# EAGLE design LearningBoardAlternate (EAGLE 7.3.0)
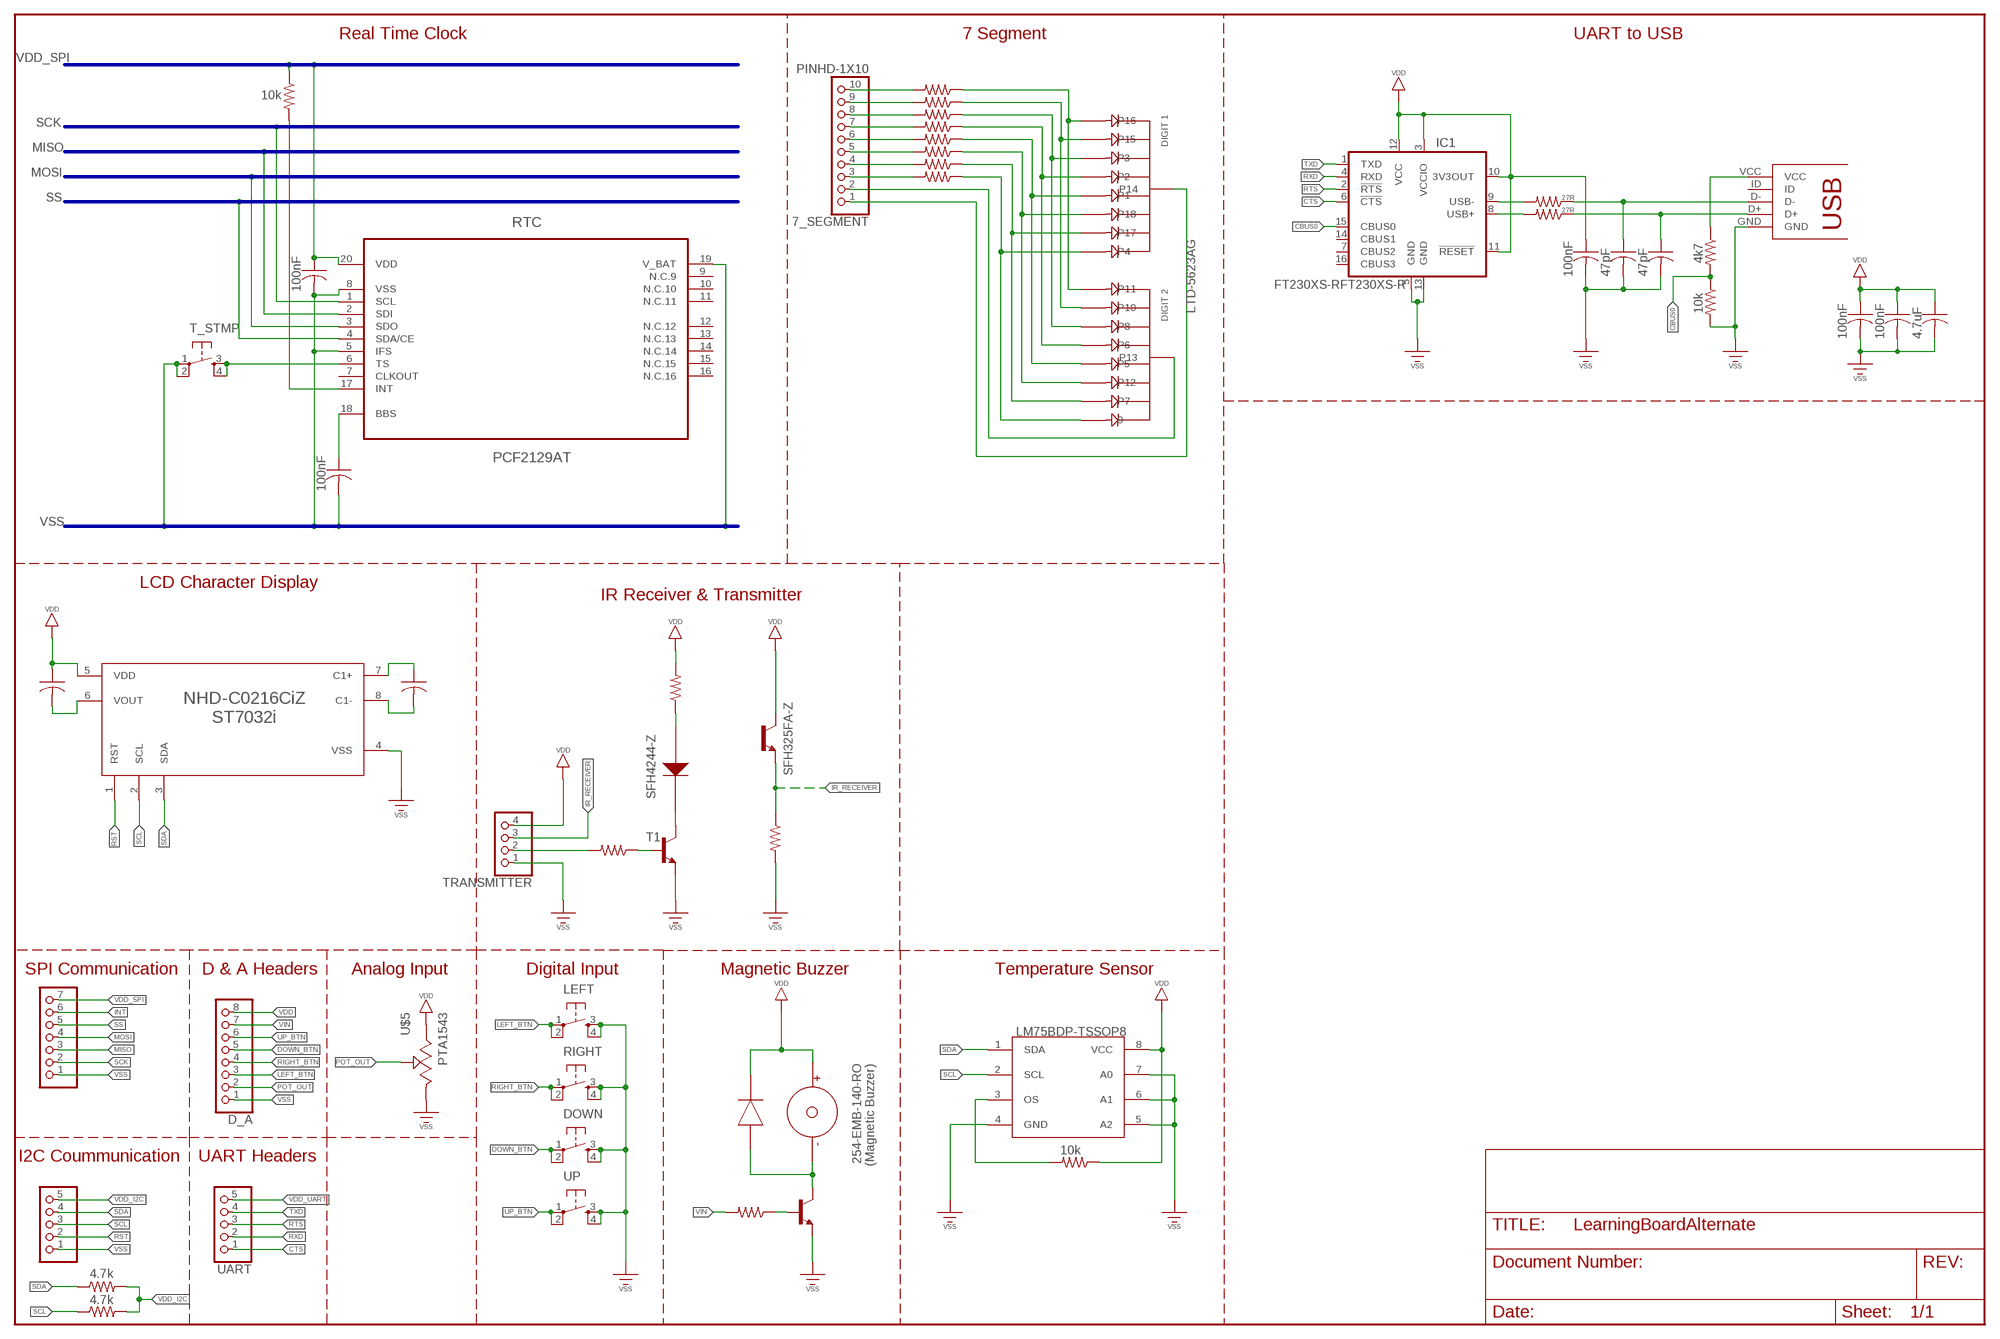
[diagram p0: schematic, sheet 1]

## Parts
7_SEGMENT  PINHD-1X10  [1X10-BIG]
C1  100nF  C-USC0805  [C0805]
C2  100nF  C-USC0805  [C0805]
C3  100nF  C-USC0805  [C0805]
C4  100nF  C-USC0805  [C0805]
C5  100nF  C-USC0805  [C0805]
C6  47pF  C-USC0805  [C0805]
C7  47pF  C-USC0805  [C0805]
C8  4.7uF  C-USC0805  [C0805]
C9  100nF  C-USC0805  [C0805]
C10  100nF  C-USC0805  [C0805]
D_A  PINHD-1X8  [1X08]
DOWN  TAC_SWITCHPTH  [TACTILE-PTH]
I2C  PINHD-1X5  [1X05]
IC1  FT230XS-RFT230XS-R  [FT230XS-R]
LEFT  TAC_SWITCHPTH  [TACTILE-PTH]
RECEIVER_  SFH325FA-Z  [SFH325FA-Z]
RIGHT  TAC_SWITCHPTH  [TACTILE-PTH]
RPU1  4.7k  RESISTOR0805-RES  [0805]
RPU2  4.7k  RESISTOR0805-RES  [0805]
RPU3  4.7k  RESISTOR0805-RES  [0805]
RPU4  10k  RESISTOR0805-RES  [0805]
RPU5  10k  RESISTOR0805-RES  [0805]
RPU6  27R  RESISTOR0805-RES  [0805]
RPU7  4.7k  RESISTOR0805-RES  [0805]
RPU8  4.7k  RESISTOR0805-RES  [0805]
RPU9  4.7k  RESISTOR0805-RES  [0805]
RPU10  4.7k  RESISTOR0805-RES  [0805]
RPU11  4.7k  RESISTOR0805-RES  [0805]
RPU12  10k  RESISTOR0805-RES  [0805]
RPU13  10k  RESISTOR0805-RES  [0805]
RPU14  10k  RESISTOR0805-RES  [0805]
RPU15  10k  RESISTOR0805-RES  [0805]
RPU16  4.7k  RESISTOR0805-RES  [0805]
RPU17  4.7k  RESISTOR0805-RES  [0805]
RPU18  27R  RESISTOR0805-RES  [0805]
RPU19  4k7  RESISTOR0805-RES  [0805]
RPU20  10k  RESISTOR0805-RES  [0805]
SPI  PINHD-1X7  [1X07]
T1  MMBT3904LT1-NPN-SOT23-BEC  [SOT23-BEC]
T2  MMBT3904LT1-NPN-SOT23-BEC  [SOT23-BEC]
T_STMP  TAC_SWITCHPTH  [TACTILE-PTH]
TRANSMITTER  PINHD-1X4  [1X04]
TRANSMITTER_  SFH4244-Z  [SFH4244-Z]
U$1  PCF2129AT  [PCF2129AT]
U$2  NHD-C0216CIZ-FN-FBW-3V  [NHD-C0216CIZ-FN-FBW-3V]
U$3  LTD-5623AG  [LTD-5623AG]
U$5  PTA1543  [PTA1543]
U$8  254-EMB-140-RO  [254-EMB-140-RO]
U$9  1N4148X-TP  [SOD523]
U$10  10118192-0001LF  [10118192-0001LF]
U$11  LM75BDP-TSSOP8  [TSSOP8]
UART  PINHD-1X5  [1X05]
UP  TAC_SWITCHPTH  [TACTILE-PTH]

## Nets
CBUS0: IC1.15(CBUS0) RPU19.2 RPU20.1
CTS: IC1.6(!CTS) UART.1
DIN: RPU13.2 TRANSMITTER.2
DOWN_BTN: D_A.5 DOWN.1 DOWN.2
INT: RPU4.2 SPI.6 U$1.17(INT)
IR_RECEIVER: RECEIVER_.E RPU14.1 TRANSMITTER.3
LEFT_BTN: D_A.3 LEFT.1 LEFT.2
MISO: SPI.3 U$1.2(SDI)
MOSI: SPI.4 U$1.3(SDO)
N$1: C1.2 U$2.6(VOUT)
N$2: C2.1 U$2.7(C1+)
N$3: C2.2 U$2.8(C1-)
N$4: T2.C U$8.NEGATIVE U$9.A
N$5: RPU1.1 U$3.P11 U$3.P16
N$6: RPU2.1 U$3.P10 U$3.P15
N$8: RPU7.1 U$3.P2 U$3.P6
N$9: RPU3.1 U$3.P3 U$3.P8
N$10: RPU8.1 U$3.P1 U$3.P5
N$11: RPU9.1 U$3.P12 U$3.P18
N$12: RPU10.1 U$3.P7 U$3.P17
N$13: RPU11.1 U$3.P4 U$3.P9
N$14: 7_SEGMENT.10 RPU1.2
N$15: 7_SEGMENT.9 RPU2.2
N$16: 7_SEGMENT.8 RPU3.2
N$17: 7_SEGMENT.7 RPU7.2
N$18: 7_SEGMENT.6 RPU8.2
N$19: 7_SEGMENT.5 RPU9.2
N$20: 7_SEGMENT.4 RPU10.2
N$21: 7_SEGMENT.3 RPU11.2
N$22: 7_SEGMENT.2 U$3.P13
N$23: 7_SEGMENT.1 U$3.P14
N$24: T1.C TRANSMITTER_.C
N$25: RPU12.1 TRANSMITTER_.A
N$26: RPU13.1 T1.B
N$27: T_STMP.3 T_STMP.4 U$1.6(TS)
N$29: RPU15.1 T2.B
N$30: C4.1 U$1.18(BBS)
N$31: RPU5.2 U$11.3(OS)
N$33: IC1.9(USB-) RPU6.2
N$34: C7.1 RPU6.1 U$10.D-
N$35: C6.1 RPU18.1 U$10.D+
N$36: IC1.8(USB+) RPU18.2
N$38: RPU19.1 U$10.VCC
POT_OUT: D_A.2 U$5.2
RIGHT_BTN: D_A.4 RIGHT.1 RIGHT.2
RST: I2C.2 U$2.1(RST)
RTS: IC1.2(!RTS) UART.3
RXD: IC1.4(RXD) UART.2
SCK: SPI.2 U$1.1(SCL)
SCL: I2C.3 RPU17.1 U$2.2(SCL) U$11.2(SCL)
SDA: I2C.4 RPU16.1 U$2.3(SDA) U$11.1(SDA)
SS: SPI.5 U$1.4(SDA/CE)
TXD: IC1.1(TXD) UART.4
UP_BTN: D_A.6 UP.1 UP.2
VDD: D_A.8 U$5.3 U$8.POSITIVE U$9.C
VDD_I2C: C1.1 I2C.5 RPU5.1 RPU16.2 RPU17.2 U$2.5(VDD) U$11.8(VCC) ; supply symbol labelled VDD
VDD_IR: RECEIVER_.C RPU12.2 TRANSMITTER.4 ; supply symbol labelled VDD
VDD_SPI: C3.1 RPU4.1 SPI.7 U$1.20(VDD)
VDD_UART: C5.1 C8.1 C9.1 C10.1 IC1.3(VCCIO) IC1.10(3V3OUT) IC1.11(!RESET) IC1.12(VCC) UART.5 ; supply symbol labelled VDD
VIN: D_A.7 RPU15.2
VSS: C3.2 C4.2 C5.2 C6.2 C7.2 C8.2 C9.2 C10.2 D_A.1 DOWN.3 DOWN.4 I2C.1 IC1.5(GND) IC1.13(GND) LEFT.3 LEFT.4 RIGHT.3 RIGHT.4 RPU14.2 RPU20.2 SPI.1 T1.E T2.E T_STMP.1 T_STMP.2 TRANSMITTER.1 U$1.5(IFS) U$1.8(VSS) U$1.19(V_BAT) U$2.4(VSS) U$5.1 U$10.GND U$11.4(GND) U$11.5(A2) U$11.6(A1) U$11.7(A0) UP.3 UP.4
Unconnected: IC1.7(CBUS2) IC1.14(CBUS1) IC1.16(CBUS3) U$1.7(CLKOUT) U$1.9(N.C.9) U$1.10(N.C.10) U$1.11(N.C.11) U$1.12(N.C.12) U$1.13(N.C.13) U$1.14(N.C.14) U$1.15(N.C.15) U$1.16(N.C.16) U$10.ID

## Buses
VDD_SPI
SCK
MISO
MOSI
SS
VSS

## Notes on the sheet
- Real Time Clock | 7 Segment | UART to USB
- LCD Character Display
- IR Receiver & Transmitter
- SPI Communication | D & A Headers | Analog Input | Digital Input | Magnetic Buzzer | Temperature Sensor
- I2C Coummunication | UART Headers

## Library data of the parts
7_SEGMENT = adafruit:PINHD-1X10: Pin header 1x10 0.1" spacing With round pins
C1-C10 = resistor:C-US: CAPACITOR, American symbol
D_A = pinhead:PINHD-1X8: PIN HEADER
DOWN LEFT RIGHT T_STMP UP = SparkFun-Electromechanical:TAC_SWITCH: Momentary Switch Button commonly used for reset or general input. Spark Fun Electronics SKU : COM-00097 SMT- SWCH-08247
I2C UART = pinhead:PINHD-1X5: PIN HEADER
IC1 = AllAboutEE:FT230XS-R: BASIC USB to UART IC
RECEIVER_ = AllAboutEE:SFH325FA-Z: PHOTOTRANSISTOR; IC_ON_MAX: 15mA; MF: Osram Opto Semiconductor; MPN: SFH 325 FA-Z; VCE_SAT: 150mV; WAVELENGTH: 980nm
RPU1-RPU20 = SparkFun-Passives:RESISTOR: Resistor Basic schematic elements and footprints for 0603, 1206, and PTH resistors.
SPI = pinhead:PINHD-1X7: PIN HEADER
T1 T2 = transistor:*-NPN-: NPN Transistror BF959 corrected 2008.03.06
TRANSMITTER = pinhead:PINHD-1X4: PIN HEADER
TRANSMITTER_ = AllAboutEE:SFH4244-Z: Infrared Emitters - High Power HIGH PWR 940nm HALF ANGLE +/-60DEG
U$1 = AllAboutEE:PCF2129AT
U$2 = AllAboutEE:NHD-C0216CIZ-FN-FBW-3V: LCD Character Display Modules & Accessories; CONTROLLER: ST7032i-oD; COUNT_LINE: 16x2; DISPLAY_MODE: Transflective; INTERFACE: I2C; MANUFACTURER: Newhaven Display; VSUPPLY: 3v; VSUPPLY_MAX: 3.3v
U$3 = AllAboutEE:LTD-5623AG
U$5 = AllAboutEE:PTA1543: Slide Potentiometers 10MM SHAFT NO DET 15MM STRK SNG LIN 10 kOhms 50 mW 20 %; POWER_RATING: 50mW; RESISTANCE: 10kOhms; TOLERANCE: 20%
U$8 = AllAboutEE:254-EMB-140-RO: Magnetic Buzzer. Audio Indicators & Alerts 12 x 8.5mm 2048Hz; CURRENT_RATING: 35mA; FREQUENCY: 2048Hz
U$9 = AllAboutEE:1N4148X-TP
U$10 = AllAboutEE:10118192-0001LF: USB Connectors 5P MICRO USB TYPE B RECEPTACLE.; COLOR: Black; GENDER: Female
U$11 = AllAboutEE:LM75BDP-TSSOP8; INTERFACE: I2C, 2-Wire, SMBus; MAX_OPERATING_TEMPERATURE: +125C; MINIMUM_OPERATING_TEMPERATURE: -55C; RESOLUTION: 11 bit; VSUPPLY_MAX: 5.5v; VSUPPLY_MIN: 2.8v

## Board
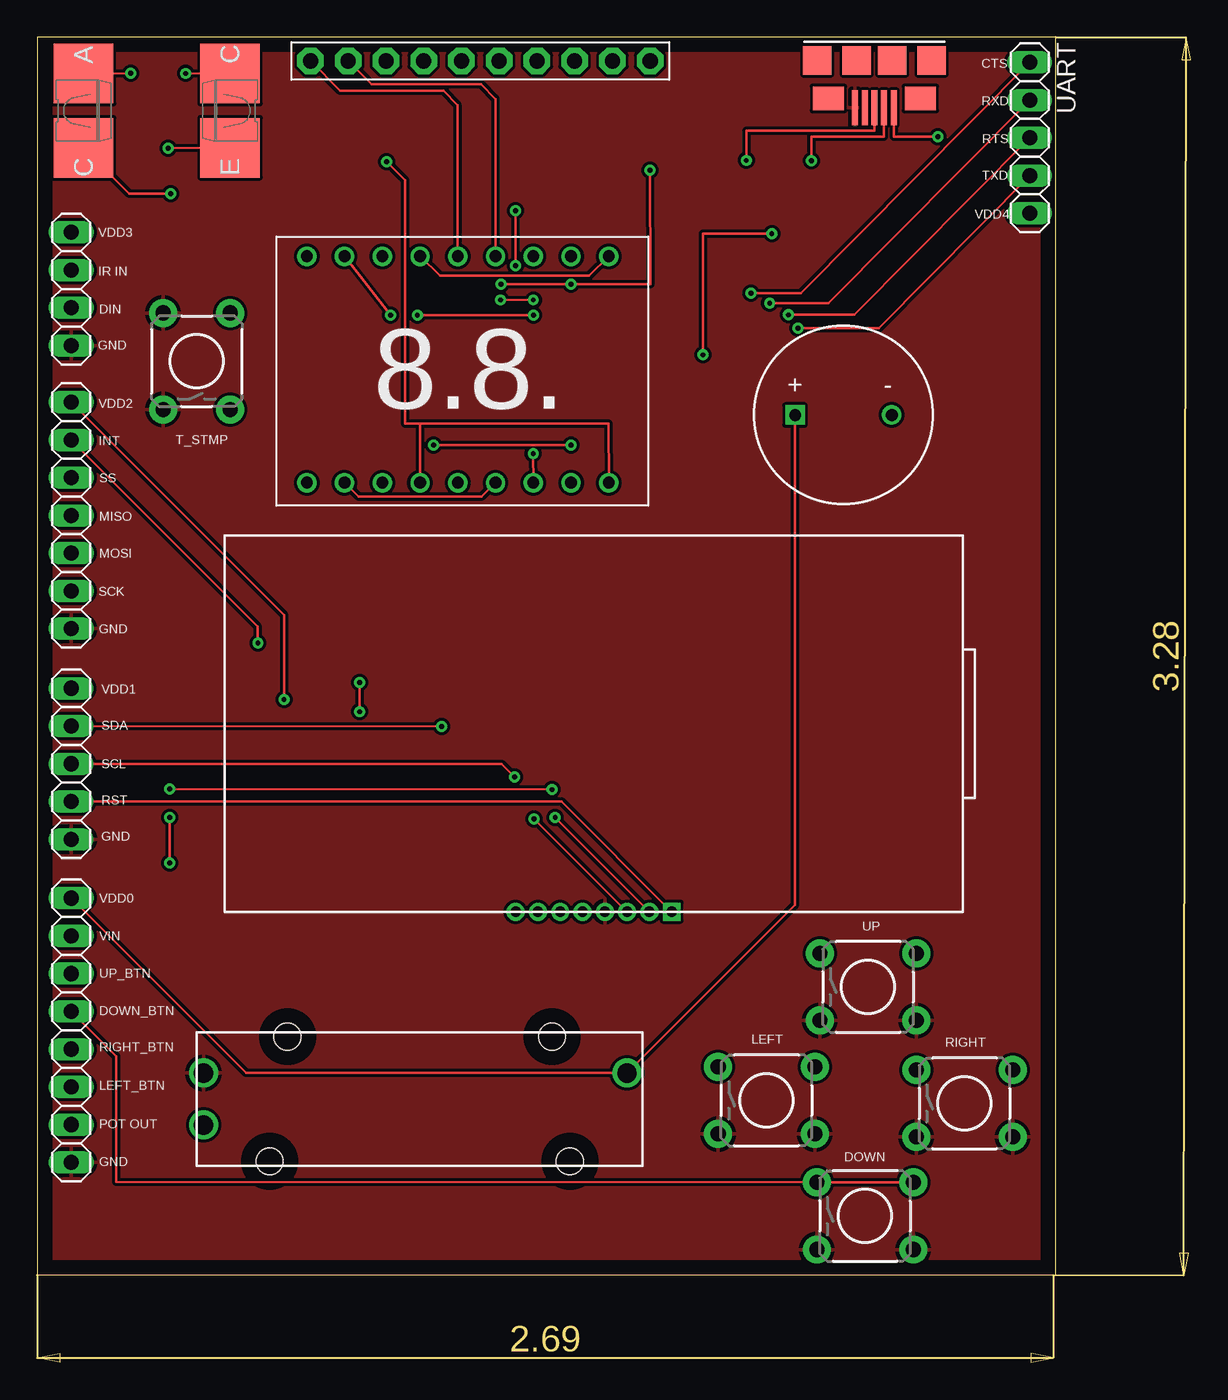
[diagram p1: board, top side]
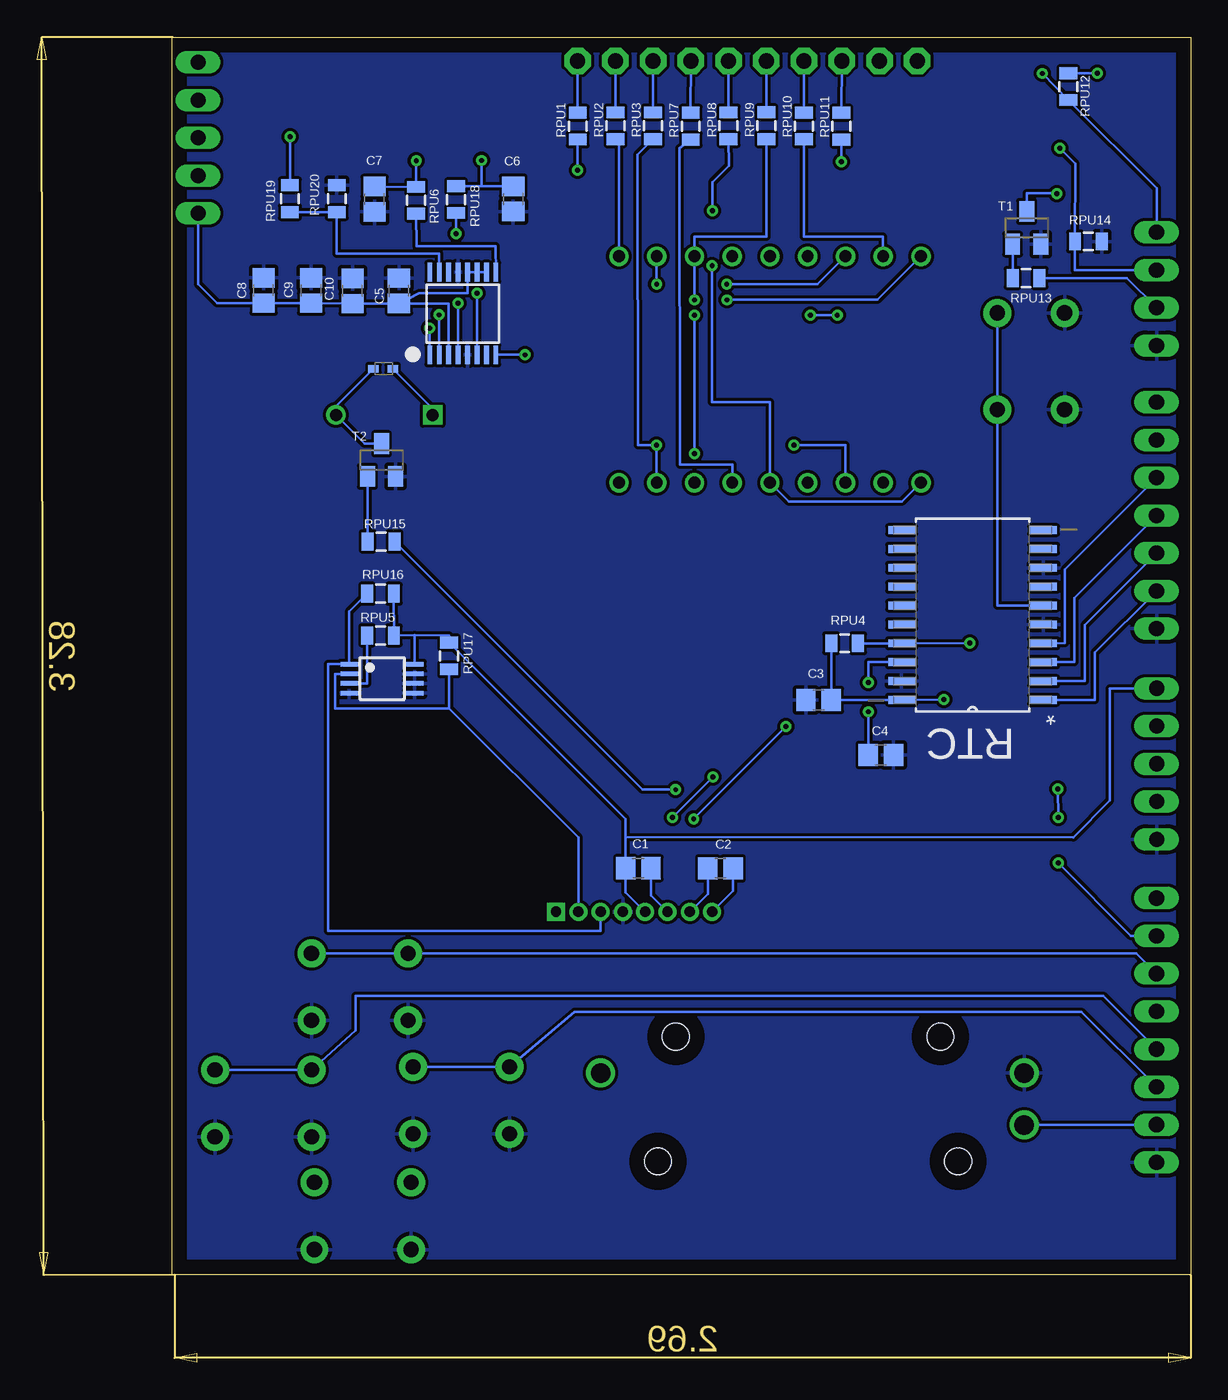
[diagram p2: board, bottom side, seen from below]

Size 68.53 x 83.29 mm. Coordinates in mm from the lower left corner, seen from the top.
Outline: 0,0 68.53,0 68.53,83.29 0,83.29 0,0
Copper layers (1*16): Top 0.035mm / dielectric 1.5mm / Bottom 0.035mm
Design rules "default": minimum track width 10mil, minimum drill 24mil, track to track 8mil, track to pad 8mil, pad to pad 8mil, via to via 8mil, smd to smd 8mil, copper to edge 40mil, drill to drill 8mil, minimum pad ring 10mil, minimum via ring 8mil, stop-mask expansion 4mil, vias tented up to drill 0mil, thermal gap 10mil

### Footprints (pad centres in the part's own frame; a part is rotated, then mirrored left to right if it is on the bottom)
1X10-BIG = drill 1.016 pad 1.778 octagon: 1 -11.43,0; 2 -8.89,0; 3 -6.35,0; 4 -3.81,0; 5 -1.27,0; 6 1.27,0; 7 3.81,0; 8 6.35,0; 9 8.89,0; 10 11.43,0
C0805 = smd 1.3 x 1.5: 1 -0.85,0; 2 0.85,0
1X08 = drill 1.016 long: 1 -8.89,0; 2 -6.35,0; 3 -3.81,0; 4 -1.27,0; 5 1.27,0; 6 3.81,0; 7 6.35,0; 8 8.89,0
TACTILE-PTH = drill 1.016 pad 1.88: 1 -3.251,2.261; 2 3.251,2.261; 3 -3.251,-2.261; 4 3.251,-2.261
1X05 = drill 1.016 long: 1 -5.08,0; 2 -2.54,0; 3 0,0; 4 2.54,0; 5 5.08,0
FT230XS-R = smd 0.32 x 1.26: 1 -2.223,-2.779; 2 -1.588,-2.779; 3 -0.953,-2.779; 4 -0.318,-2.779; 5 0.317,-2.779; 6 0.952,-2.779; 7 1.587,-2.779; 8 2.222,-2.779; 9 2.222,2.779; 10 1.587,2.779; 11 0.952,2.779; 12 0.317,2.779; 13 -0.318,2.779; 14 -0.953,2.779; 15 -1.588,2.779; 16 -2.223,2.779
SFH325FA-Z = smd 4 x 4: C 0,-2.5; E 0,2.5
0805 = smd 0.8 x 1.2: 1 -0.9,0; 2 0.9,0
1X07 = drill 1.016 long: 1 -7.62,0; 2 -5.08,0; 3 -2.54,0; 4 0,0; 5 2.54,0; 6 5.08,0; 7 7.62,0
SOT23-BEC = smd 1 x 1.4: B -0.95,-1.1; C 0,1.1; E 0.95,-1.1
1X04 = drill 1.016 long: 1 -3.81,0; 2 -1.27,0; 3 1.27,0; 4 3.81,0
SFH4244-Z = smd 4 x 4: A 0,2.5; C 0,-2.5
PCF2129AT = smd 1.803 x 0.533: 1 -4.775,5.715; 2 -4.775,4.445; 3 -4.775,3.175; 4 -4.775,1.905; 5 -4.775,0.635; 6 -4.775,-0.635; 7 -4.775,-1.905; 8 -4.775,-3.175; 9 -4.775,-4.445; 10 -4.775,-5.715; 11 4.775,-5.715; 12 4.775,-4.445; 13 4.775,-3.175; 14 4.775,-1.905; 15 4.775,-0.635; 16 4.775,0.635; 17 4.775,1.905; 18 4.775,3.175; 19 4.775,4.445; 20 4.775,5.715
NHD-C0216CIZ-FN-FBW-3V = drill 0.7 square: 1 30.1,-25.3 | drill 0.7: 2 28.6,-25.3; 3 27.1,-25.3; 4 25.6,-25.3; 5 24.1,-25.3; 6 22.6,-25.3; 7 21.1,-25.3; 8 19.6,-25.3
LTD-5623AG = drill 0.8: P1 2.04,1.54; P2 4.58,1.54; P3 7.12,1.54; P4 9.66,1.54; P5 12.2,1.54; P6 14.74,1.54; P7 17.28,1.54; P8 19.82,1.54; P9 22.36,1.54; P10 22.36,16.78; P11 19.82,16.78; P12 17.28,16.78; P13 14.74,16.78; P14 12.2,16.78; P15 9.66,16.78; P16 7.12,16.78; P17 4.58,16.78; P18 2.04,16.78
PTA1543 = drill 1.3: 1 0.45,6.25; 2 0.45,2.75; 3 28.95,6.25 | hole 1.8: 4.9,0.3; 6.1,8.7; 23.9,8.7; 25.1,0.3
254-EMB-140-RO = drill 0.8: NEGATIVE 3.25,0 | drill 0.8 square: POSITIVE -3.25,0
SOD523 = smd 0.7 x 0.5: A 0.7,0; C -0.6,0
10118192-0001LF = smd 0.4 x 2.35: D+ -0.05,1.725; D- -0.7,1.725; GND 1.25,1.725; ID 0.6,1.725; VCC -1.35,1.725 | smd 2.1 x 1.6: P$1 -3.15,1.1; P$2 3.05,1.1 | smd 1.9 x 1.9: P$3 -3.9,-1.45; P$4 -1.25,-1.45; P$5 1.15,-1.45; P$6 3.8,-1.45
TSSOP8 = smd 1.2 x 0.305: 1 -2.2,0.975; 2 -2.2,0.325; 3 -2.2,-0.325; 4 -2.2,-0.975; 5 2.2,-0.975; 6 2.2,-0.325; 7 2.2,0.325; 8 2.2,0.975

### Placement (x,y rotation side)
7_SEGMENT  29.82,81.69 0 top
C1  37.16,27.36 0 bottom
C2  31.64,27.35 0 bottom
C3  25.03,38.68 180 bottom
C4  20.84,34.98 0 bottom
C5  53.27,66.22 90 bottom
C6  45.58,72.4 270 bottom
C7  54.91,72.38 270 bottom
C8  62.38,66.24 90 bottom
C9  59.18,66.24 90 bottom
C10  56.4,66.21 90 bottom
D_A  2.29,16.46 90 top
DOWN  55.71,3.96 0 top
I2C  2.28,34.39 90 top
IC1  48.97,64.69 0 bottom
LEFT  49.08,11.74 0 top
RECEIVER_  12.98,78.33 180 top
RIGHT  62.4,11.54 0 top
RPU1  41.24,77.3 90 bottom
RPU2  38.7,77.32 90 bottom
RPU3  36.17,77.32 90 bottom
RPU4  23.28,42.5 0 bottom
RPU5  54.51,43.03 180 bottom
RPU6  52.12,72.31 270 bottom
RPU7  33.64,77.29 90 bottom
RPU8  31.09,77.32 90 bottom
RPU9  28.55,77.33 90 bottom
RPU10  26.01,77.31 90 bottom
RPU11  23.49,77.29 90 bottom
RPU12  8.23,79.96 270 bottom
RPU13  11.07,67.08 0 bottom
RPU14  6.87,69.54 0 bottom
RPU15  54.48,49.36 0 bottom
RPU16  54.51,45.84 0 bottom
RPU17  49.9,41.65 90 bottom
RPU18  49.43,72.36 270 bottom
RPU19  60.61,72.42 270 bottom
RPU20  57.45,72.42 90 bottom
SPI  2.29,51.1 90 top
T1  11.02,70.46 0 bottom
T2  54.44,54.83 0 bottom
T_STMP  10.74,61.48 90 top
TRANSMITTER  2.29,66.34 90 top
TRANSMITTER_  3.12,78.33 0 top
U$1  14.67,44.4 180 bottom
U$2  12.6,49.73 0 top
U$3  16.1,51.77 0 top
U$5  10.74,7.33 0 top
U$8  54.25,57.86 0 top
U$9  54.29,60.98 180 bottom
U$10  56.29,80.26 180 top
U$11  54.41,40.12 0 bottom
UART  66.79,76.51 270 top
UP  55.91,19.38 0 top

### Tracks (layer width: path | path; a pad name or v marks a point on that pad's centre or on a via)
CBUS0
  Bottom 0.152: RPU19.2 RPU20.1 57.46,68.73 50.56,68.72 IC1.15
CTS  (via drill 0.33)
  Top 0.152: UART.1 51.39,66.07 v48.02,66.07
  Bottom 0.152: v48.02,66.07 IC1.6
DIN
  Bottom 0.152: TRANSMITTER.2 4.29,67.08 RPU13.2
DOWN_BTN
  Top 0.152: D_A.5 5.32,14.7 5.32,6.25 DOWN.1 DOWN.2
INT  (via drill 0.33)
  Top 0.152: SPI.6 14.85,43.62 v14.85,42.51
  Bottom 0.152: RPU4.2 U$1.17 v14.85,42.51
IR_RECEIVER  (via drill 0.33)
  Top 0.152: v8.8,75.82 RECEIVER_.E
  Bottom 0.152: v8.8,75.82 7.76,74.78 RPU14.1 7.77,67.61 TRANSMITTER.3
LEFT_BTN
  Bottom 0.152: LEFT.2 LEFT.1 41.46,17.71 7.35,17.71 D_A.3
MISO
  Bottom 0.152: SPI.3 7.12,43.73 7.12,39.95 U$1.2
MOSI
  Bottom 0.152: SPI.4 7.83,45.56 7.83,41.23 U$1.3
N$1
  Bottom 0.152: C1.2 36.31,25.55 U$2.6
N$2
  Bottom 0.152: C2.1 32.49,25.64 U$2.7
N$3
  Bottom 0.152: C2.2 30.79,25.84 U$2.8
N$4
  Bottom 0.152: U$9.A 57.5,58.46 U$8.NEGATIVE 55.57,55.93 T2.C
N$5  (via drill 0.33)
  Top 0.152: v41.24,74.34 41.26,66.67 v35.92,66.67 v31.21,66.67
  Bottom 0.152: U$3.P16 25.1,66.67 v31.21,66.67 | v41.24,74.34 RPU1.1 | U$3.P11 v35.92,66.67
N$6
  Top 0.152: U$3.P10 37.15,67.23 27.09,67.23 U$3.P15
  Bottom 0.152: RPU2.1 38.46,76.18 U$3.P10
N$8
  Top 0.152: U$3.P2 21.62,52.37 29.91,52.37 U$3.P6
  Bottom 0.152: RPU7.1 34.4,75.81 34.37,54.53 30.84,54.53 U$3.P6
N$9  (via drill 0.33)
  Top 0.152: v26.68,55.84 v35.93,55.84
  Bottom 0.152: U$3.P3 23.21,55.84 v26.68,55.84 | RPU3.1 37.2,75.39 37.18,55.84 v35.93,55.84 U$3.P8
N$10  (via drill 0.33)
  Top 0.152: v32.18,71.61 v32.19,67.9
  Bottom 0.152: RPU8.1 31.08,74.64 32.18,73.53 v32.18,71.61 | v32.19,67.9 32.2,58.73 28.3,58.72 U$3.P5 27.02,52.02 19.42,52.02 U$3.P1
N$11  (via drill 0.33)
  Top 0.152: v31.19,65.61 v33.38,65.61
  Bottom 0.152: RPU9.1 28.55,69.87 33.38,69.87 U$3.P12 v33.38,65.61 | U$3.P18 21.07,65.61 v31.19,65.61
N$12  (via drill 0.33)
  Top 0.152: U$3.P7 v33.38,55.27 | v33.39,64.58 v25.58,64.58 | v23.78,64.58 U$3.P17
  Bottom 0.152: RPU10.1 26.01,69.85 20.7,69.85 U$3.P17 | v33.38,55.27 v33.39,64.58 | v25.58,64.58 v23.78,64.58
N$13  (via drill 0.33)
  Top 0.152: v23.5,74.92 24.75,73.66 24.75,57.28 25.76,57.28 | 25.76,57.28 U$3.P4 | U$3.P9 38.46,57.29 25.76,57.28
  Bottom 0.152: RPU11.1 v23.5,74.92
N$14
  Bottom 0.152: 7_SEGMENT.10 RPU1.2
N$15
  Bottom 0.152: 7_SEGMENT.9 RPU2.2
N$16
  Bottom 0.152: 7_SEGMENT.8 RPU3.2
N$17
  Bottom 0.152: 7_SEGMENT.7 RPU7.2
N$18
  Bottom 0.152: 7_SEGMENT.6 RPU8.2
N$19
  Bottom 0.152: 7_SEGMENT.5 RPU9.2
N$20
  Bottom 0.152: 7_SEGMENT.4 RPU10.2
N$21
  Bottom 0.152: 7_SEGMENT.3 RPU11.2
N$22
  Top 0.152: 7_SEGMENT.2 22.51,80.11 29.86,80.11 30.84,79.12 U$3.P13
N$23
  Top 0.152: 7_SEGMENT.1 20.4,79.68 27.33,79.68 28.3,78.7 U$3.P14
N$24  (via drill 0.33)
  Top 0.152: TRANSMITTER_.C 6.2,72.76 v8.99,72.76
  Bottom 0.152: v8.99,72.76 8.99,72.77 11.02,72.77 T1.C
N$25  (via drill 0.33)
  Top 0.152: v6.28,80.85 TRANSMITTER_.A
  Bottom 0.152: RPU12.1 v6.28,80.85
N$26
  Bottom 0.152: RPU13.1 T1.B
N$27
  Bottom 0.152: T_STMP.4 T_STMP.3 13,45.04 U$1.6
N$29
  Bottom 0.152: RPU15.1 T2.B
N$30  (via drill 0.33)
  Top 0.152: v21.69,39.85 v21.68,37.89
  Bottom 0.152: U$1.18 21.69,41.23 v21.69,39.85 | v21.68,37.89 C4.1
N$31
  Bottom 0.152: RPU5.2 55.43,39.79 U$11.3
N$33
  Bottom 0.152: RPU6.2 52.1,69.21 46.77,69.21 IC1.9
N$34  (via drill 0.33)
  Top 0.152: U$10.D- 56.99,76.6 52.1,76.6 v52.1,74.96
  Bottom 0.152: v52.1,74.96 RPU6.1 C7.1
N$35  (via drill 0.33)
  Top 0.152: U$10.D+ 56.34,76.99 47.72,76.98 v47.71,74.99
  Bottom 0.152: RPU18.1 47.71,73.25 | 47.71,73.25 C6.1 | v47.71,74.99 47.71,73.25
N$36  (via drill 0.33)
  Top 0.152: v44.79,61.91 44.79,70.05 v49.43,70.05
  Bottom 0.152: IC1.8 v44.79,61.91 | v49.43,70.05 RPU18.2
N$38  (via drill 0.33)
  Top 0.152: U$10.VCC 57.64,76.59 v60.6,76.59
  Bottom 0.152: v60.6,76.59 RPU19.1
POT_OUT
  Bottom 0.152: D_A.2 U$5.2
RIGHT_BTN
  Bottom 0.152: RIGHT.2 RIGHT.1 56.2,16.44 56.2,18.79 5.86,18.76 D_A.4
RST
  Top 0.152: U$2.1 35.28,31.85 I2C.2
RTS  (via drill 0.33)
  Top 0.152: UART.3 55,64.6 v50.56,64.6
  Bottom 0.152: v50.56,64.6 IC1.2
RXD  (via drill 0.33)
  Top 0.152: UART.2 53.24,65.39 v49.29,65.39
  Bottom 0.152: v49.29,65.39 IC1.4
SCK
  Bottom 0.152: SPI.2 6.44,41.87 6.44,38.68 U$1.1
SCL  (via drill 0.33)
  Top 0.152: U$2.2 v34.86,30.78 | v32.13,33.51 31.25,34.39 I2C.3
  Bottom 0.152: RPU17.1 49.9,38.12 | 49.9,38.12 57.58,38.12 57.58,40.44 U$11.2 | 49.9,38.12 41.2,29.43 U$2.2 | v34.86,30.78 v32.13,33.51
SDA  (via drill 0.33)
  Top 0.152: U$2.3 v33.44,30.69 | v27.22,36.91 I2C.4
  Bottom 0.152: RPU16.1 56.61,44.65 U$11.1 58.03,41.09 58.03,23.14 39.7,23.14 U$2.3 | v33.44,30.69 v27.22,36.91
SS
  Bottom 0.152: SPI.5 8.47,47.46 8.47,42.52 U$1.4
TXD  (via drill 0.33)
  Top 0.152: UART.4 56.63,63.69 v51.2,63.69
  Bottom 0.152: v51.2,63.69 IC1.1
UP_BTN
  Bottom 0.152: UP.2 UP.1 3.66,21.64 D_A.6
VDD
  Top 0.152: D_A.8 14.05,13.58 U$5.3 51,24.89 U$8.POSITIVE
  Bottom 0.152: U$9.C 51,58.29 U$8.POSITIVE
VDD_I2C
  Bottom 0.152: 52.23,43.04 49.9,43.02 RPU17.2 38.01,30.67 38.01,29.46 | 52.23,43.04 RPU5.1 RPU16.2 | U$11.8 52.23,43.04 | U$2.5 38.01,25.75 C1.1 38.01,29.46 | I2C.5 5.43,39.47 5.43,31.91 7.9,29.44 38.01,29.46
VDD_IR  (via drill 0.33)
  Top 0.152: v9.98,80.84 RECEIVER_.C
  Bottom 0.152: TRANSMITTER.4 2.29,73.12 RPU12.2 v9.98,80.84
VDD_SPI  (via drill 0.33)
  Top 0.152: SPI.7 16.6,44.41 v16.6,38.71
  Bottom 0.152: RPU4.1 C3.1 U$1.20 v16.6,38.71
VDD_UART
  Bottom 0.152: C5.1 C10.1 C9.1 C8.1 65.52,65.4 66.8,66.68 UART.5 | IC1.3 49.93,65.37 C5.1 | IC1.10 IC1.11 IC1.12 48.65,66.07 51.9,66.07 C5.1
VIN  (via drill 0.33)
  Top 0.152: v34.65,32.65 v8.93,32.69 | v8.91,30.79 v8.91,27.71
  Bottom 0.152: RPU15.2 36.87,32.65 v34.65,32.65 | v8.93,32.69 v8.91,30.79 | v8.91,27.71 4.01,22.81 D_A.7
VSS
  pour Top: -0.91,84.68 69.6,84.68 69.6,-1.22 -0.91,-1.22
  pour Bottom: -2.54,85.75 71.37,85.75 71.37,-3.05 -2.54,-3.05

### Text on the board
tNames: CTS | RXD | RTS | TXD | VDD4 | VDD3 | IR IN | DIN | GND | VDD2 | INT | SS | MISO | MOSI | SCK | GND | VDD1 | SDA | SCL | RST | GND | VDD0 | VIN | UP_BTN | DOWN_BTN | RIGHT_BTN | LEFT_BTN | POT OUT | GND